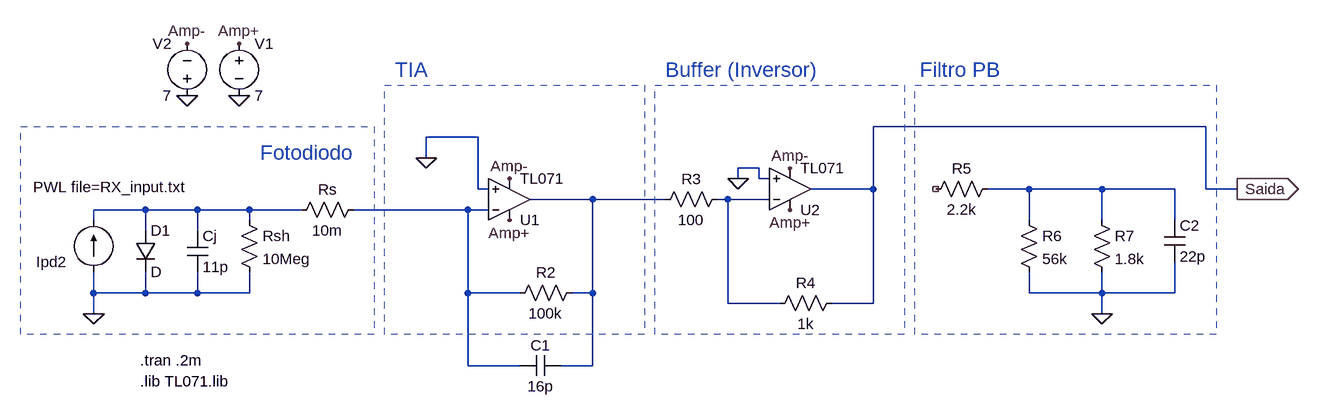
[diagram p0: schematic basic_receptor.asc]
basic_receptor.asc, the LTspice schematic file:
Version 4
SHEET 1 1100 724
WIRE 896 -80 384 -80
WIRE -224 -64 -304 -64
WIRE -304 -32 -304 -64
WIRE 208 -16 176 -16
WIRE 176 0 176 -16
WIRE 208 0 208 -16
WIRE 224 0 208 0
WIRE -224 16 -224 -64
WIRE -208 16 -224 16
WIRE 384 16 384 -80
WIRE 384 16 288 16
WIRE 624 16 560 16
WIRE 736 16 624 16
WIRE 848 16 736 16
WIRE 896 16 896 -80
WIRE 944 16 896 16
WIRE -48 32 -144 32
WIRE 64 32 -48 32
WIRE 160 32 144 32
WIRE 224 32 160 32
WIRE -736 48 -816 48
WIRE -656 48 -736 48
WIRE -576 48 -656 48
WIRE -496 48 -576 48
WIRE -240 48 -416 48
WIRE -208 48 -240 48
WIRE -816 64 -816 48
WIRE -576 64 -576 48
WIRE 624 64 624 16
WIRE 736 64 736 16
WIRE 848 64 848 16
WIRE -736 80 -736 48
WIRE -656 80 -656 48
WIRE -816 176 -816 144
WIRE -736 176 -736 144
WIRE -736 176 -816 176
WIRE -656 176 -656 144
WIRE -656 176 -736 176
WIRE -576 176 -576 144
WIRE -576 176 -656 176
WIRE -240 176 -240 48
WIRE -160 176 -240 176
WIRE -48 176 -48 32
WIRE -48 176 -80 176
WIRE 624 176 624 144
WIRE 736 176 736 144
WIRE 736 176 624 176
WIRE 848 176 848 128
WIRE 848 176 736 176
WIRE 160 192 160 32
WIRE 240 192 160 192
WIRE 384 192 384 16
WIRE 384 192 320 192
WIRE -816 208 -816 176
WIRE 736 208 736 176
WIRE -240 288 -240 176
WIRE -160 288 -240 288
WIRE -48 288 -48 176
WIRE -48 288 -96 288
FLAG -592 -208 Amp+
FLAG -592 -128 0
FLAG -672 -208 Amp-
FLAG -672 -128 0
FLAG -176 64 Amp+
FLAG -176 0 Amp-
FLAG -304 -32 0
FLAG 256 48 Amp+
FLAG 256 -16 Amp-
FLAG 176 0 0
FLAG 736 208 0
FLAG 944 16 Saida
IOPIN 944 16 Out
FLAG -816 208 0
SYMBOL OpAmps\\opamp2 -176 96 M180
SYMATTR InstName U1
SYMATTR Value TL071
SYMBOL voltage -592 -224 R0
WINDOW 123 0 0 Left 0
WINDOW 39 0 0 Left 0
SYMATTR InstName V1
SYMATTR Value 7
SYMBOL voltage -672 -112 R180
WINDOW 0 24 96 Left 2
WINDOW 3 24 16 Left 2
WINDOW 123 0 0 Left 0
WINDOW 39 0 0 Left 0
SYMATTR InstName V2
SYMATTR Value 7
SYMBOL res -64 160 R90
WINDOW 0 0 56 VBottom 2
WINDOW 3 32 56 VTop 2
SYMATTR InstName R2
SYMATTR Value 100k
SYMBOL res 160 16 R90
WINDOW 0 0 56 VBottom 2
WINDOW 3 32 56 VTop 2
SYMATTR InstName R3
SYMATTR Value 100
SYMBOL OpAmps\\opamp2 256 80 M180
SYMATTR InstName U2
SYMATTR Value TL071
SYMBOL res 224 208 R270
WINDOW 0 32 56 VTop 2
WINDOW 3 0 56 VBottom 2
SYMATTR InstName R4
SYMATTR Value 1k
SYMBOL res 464 32 R270
WINDOW 0 32 56 VTop 2
WINDOW 3 0 56 VBottom 2
SYMATTR InstName R5
SYMATTR Value 2.2k
SYMBOL res 608 48 R0
SYMATTR InstName R6
SYMATTR Value 56k
SYMBOL res 720 48 R0
SYMATTR InstName R7
SYMATTR Value 1.8k
SYMBOL cap 832 64 R0
SYMATTR InstName C2
SYMATTR Value 22p
SYMBOL diode -752 80 R0
SYMATTR InstName D1
SYMBOL cap -672 80 R0
SYMATTR InstName Cj
SYMATTR Value 11p
SYMBOL res -592 48 R0
SYMATTR InstName Rsh
SYMATTR Value 10Meg
SYMBOL res -400 32 R90
WINDOW 0 0 56 VBottom 2
WINDOW 3 32 56 VTop 2
SYMATTR InstName Rs
SYMATTR Value 10m
SYMBOL current -816 144 R180
WINDOW 3 93 131 Right 2
WINDOW 123 0 0 Left 0
WINDOW 39 0 0 Left 0
WINDOW 0 88 16 Right 2
SYMATTR Value PWL file=RX_input.txt
SYMATTR InstName Ipd2
SYMBOL cap -96 272 R90
WINDOW 0 0 32 VBottom 2
WINDOW 3 32 32 VTop 2
SYMATTR InstName C1
SYMATTR Value 16p
TEXT -744 280 Left 2 !.tran .2m
TEXT -744 312 Left 2 !.lib TL071.lib
TEXT -560 -40 Left 3 ;Fotodiodo
TEXT -352 -168 Left 3 ;TIA
TEXT 64 -168 Left 3 ;Buffer (Inversor)
TEXT 456 -168 Left 3 ;Filtro PB
RECTANGLE Normal 32 240 -368 -144 2
RECTANGLE Normal 432 240 48 -144 2
RECTANGLE Normal 912 240 448 -144 2
RECTANGLE Normal -384 240 -928 -80 2

The netlist it stands for:
* basic_receptor.asc
XU1 0 N005 Amp+ Amp- N002 TL071  ; pins In+ In- V+ V- OUT
V1 Amp+ 0 7
V2 0 Amp- 7
R2 N002 N005 100k
R3 N003 N002 100
XU2 0 N003 Amp+ Amp- Saida TL071  ; pins In+ In- V+ V- OUT
R4 N003 Saida 1k
R5 NC_01 N001 2.2k
R6 N001 0 56k
R7 N001 0 1.8k
C2 N001 0 22p
D1 N004 0 D
Cj N004 0 11p
Rsh N004 0 10Meg
Rs N005 N004 10m
Ipd2 0 N004 PWL file=RX_input.txt
C1 N002 N005 16p
.model D D
.lib standard.dio
.tran .2m
.lib TL071.lib
* Fotodiodo
* TIA
* Buffer (Inversor)
* Filtro PB
.backanno
.end